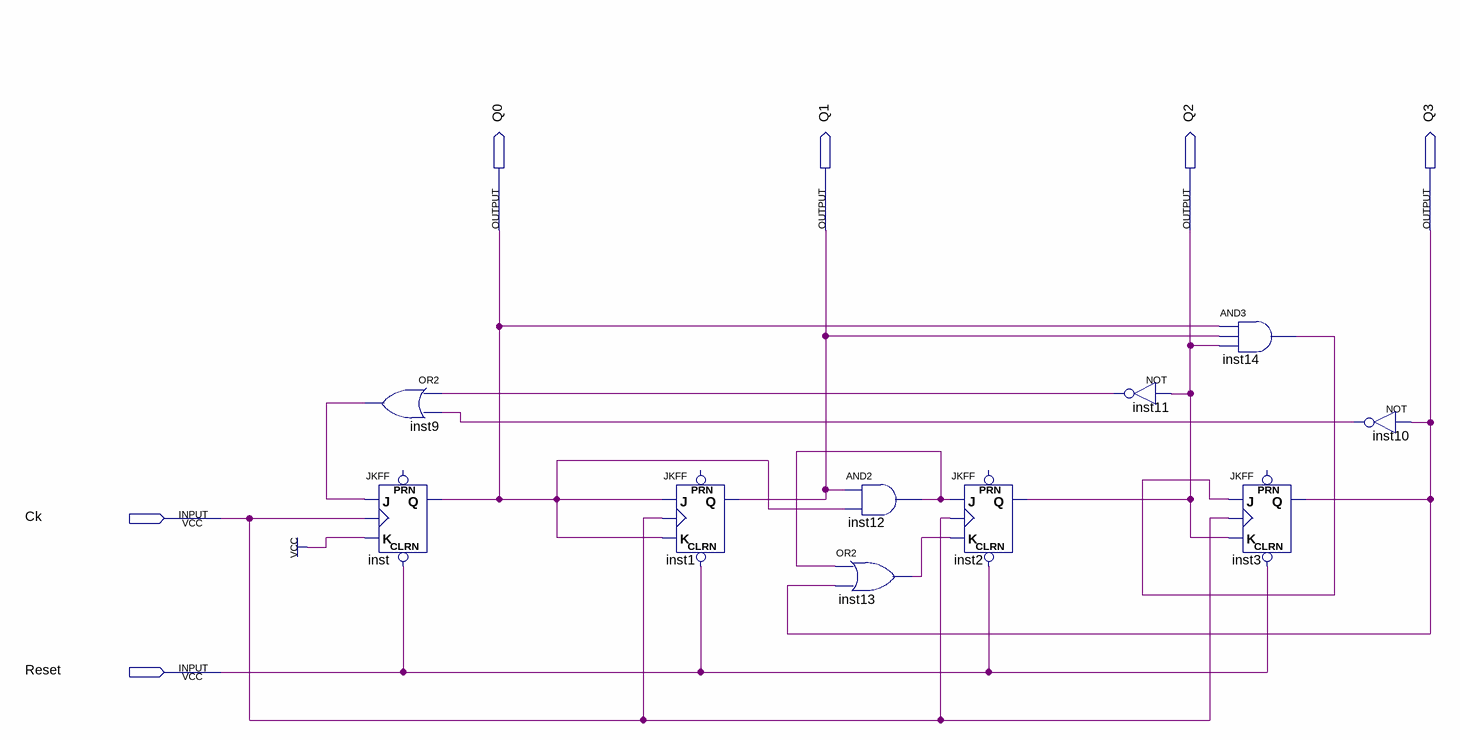
[diagram p0: schematic sheet]
// Quartus schematic Num0_12.bdf as structural Verilog: 10 symbols, 6 pins
module Num0_12 (
  input  Ck,
  input  Reset,
  output Q0,
  output Q1,
  output Q2,
  output Q3
);

  wire inst9_out, inst10_out, inst11_out, inst12_out, inst13_out, inst14_out;

  or inst9 (inst9_out, inst11_out, inst10_out);
  JKFF inst (.CLRN(Reset), .K(1'b1), .J(inst9_out), .CLK(Ck), .Q(Q0));  // open: PRN
  JKFF inst1 (.CLRN(Reset), .K(Q0), .J(Q0), .CLK(Ck), .Q(Q1));  // open: PRN
  or inst13 (inst13_out, inst12_out, Q3);
  and inst12 (inst12_out, Q1, Q0);
  JKFF inst2 (.CLRN(Reset), .K(inst13_out), .J(inst12_out), .CLK(Ck), .Q(Q2));  // open: PRN
  not inst11 (inst11_out, Q2);
  and inst14 (inst14_out, Q0, Q1, Q2);
  JKFF inst3 (.CLRN(Reset), .K(Q2), .J(inst14_out), .CLK(Ck), .Q(Q3));  // open: PRN
  not inst10 (inst10_out, Q3);
endmodule
